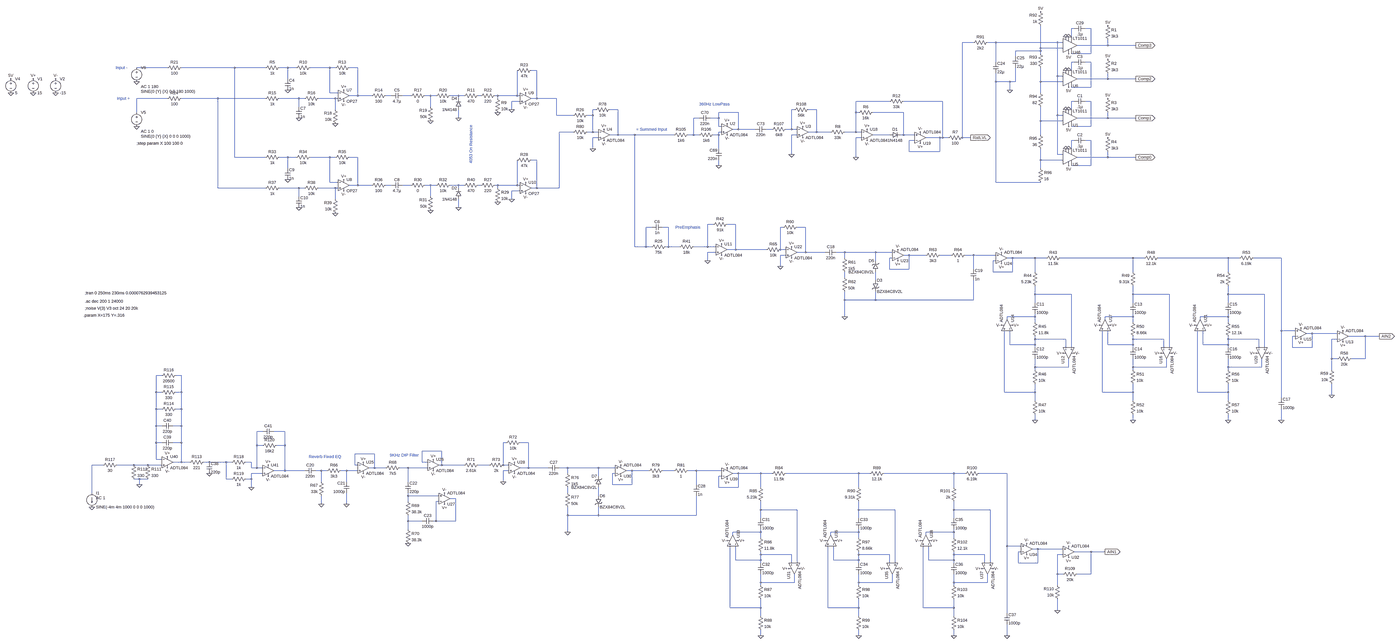
[diagram p0: schematic stargate_323_ltspice_comparator.asc, whole sheet]
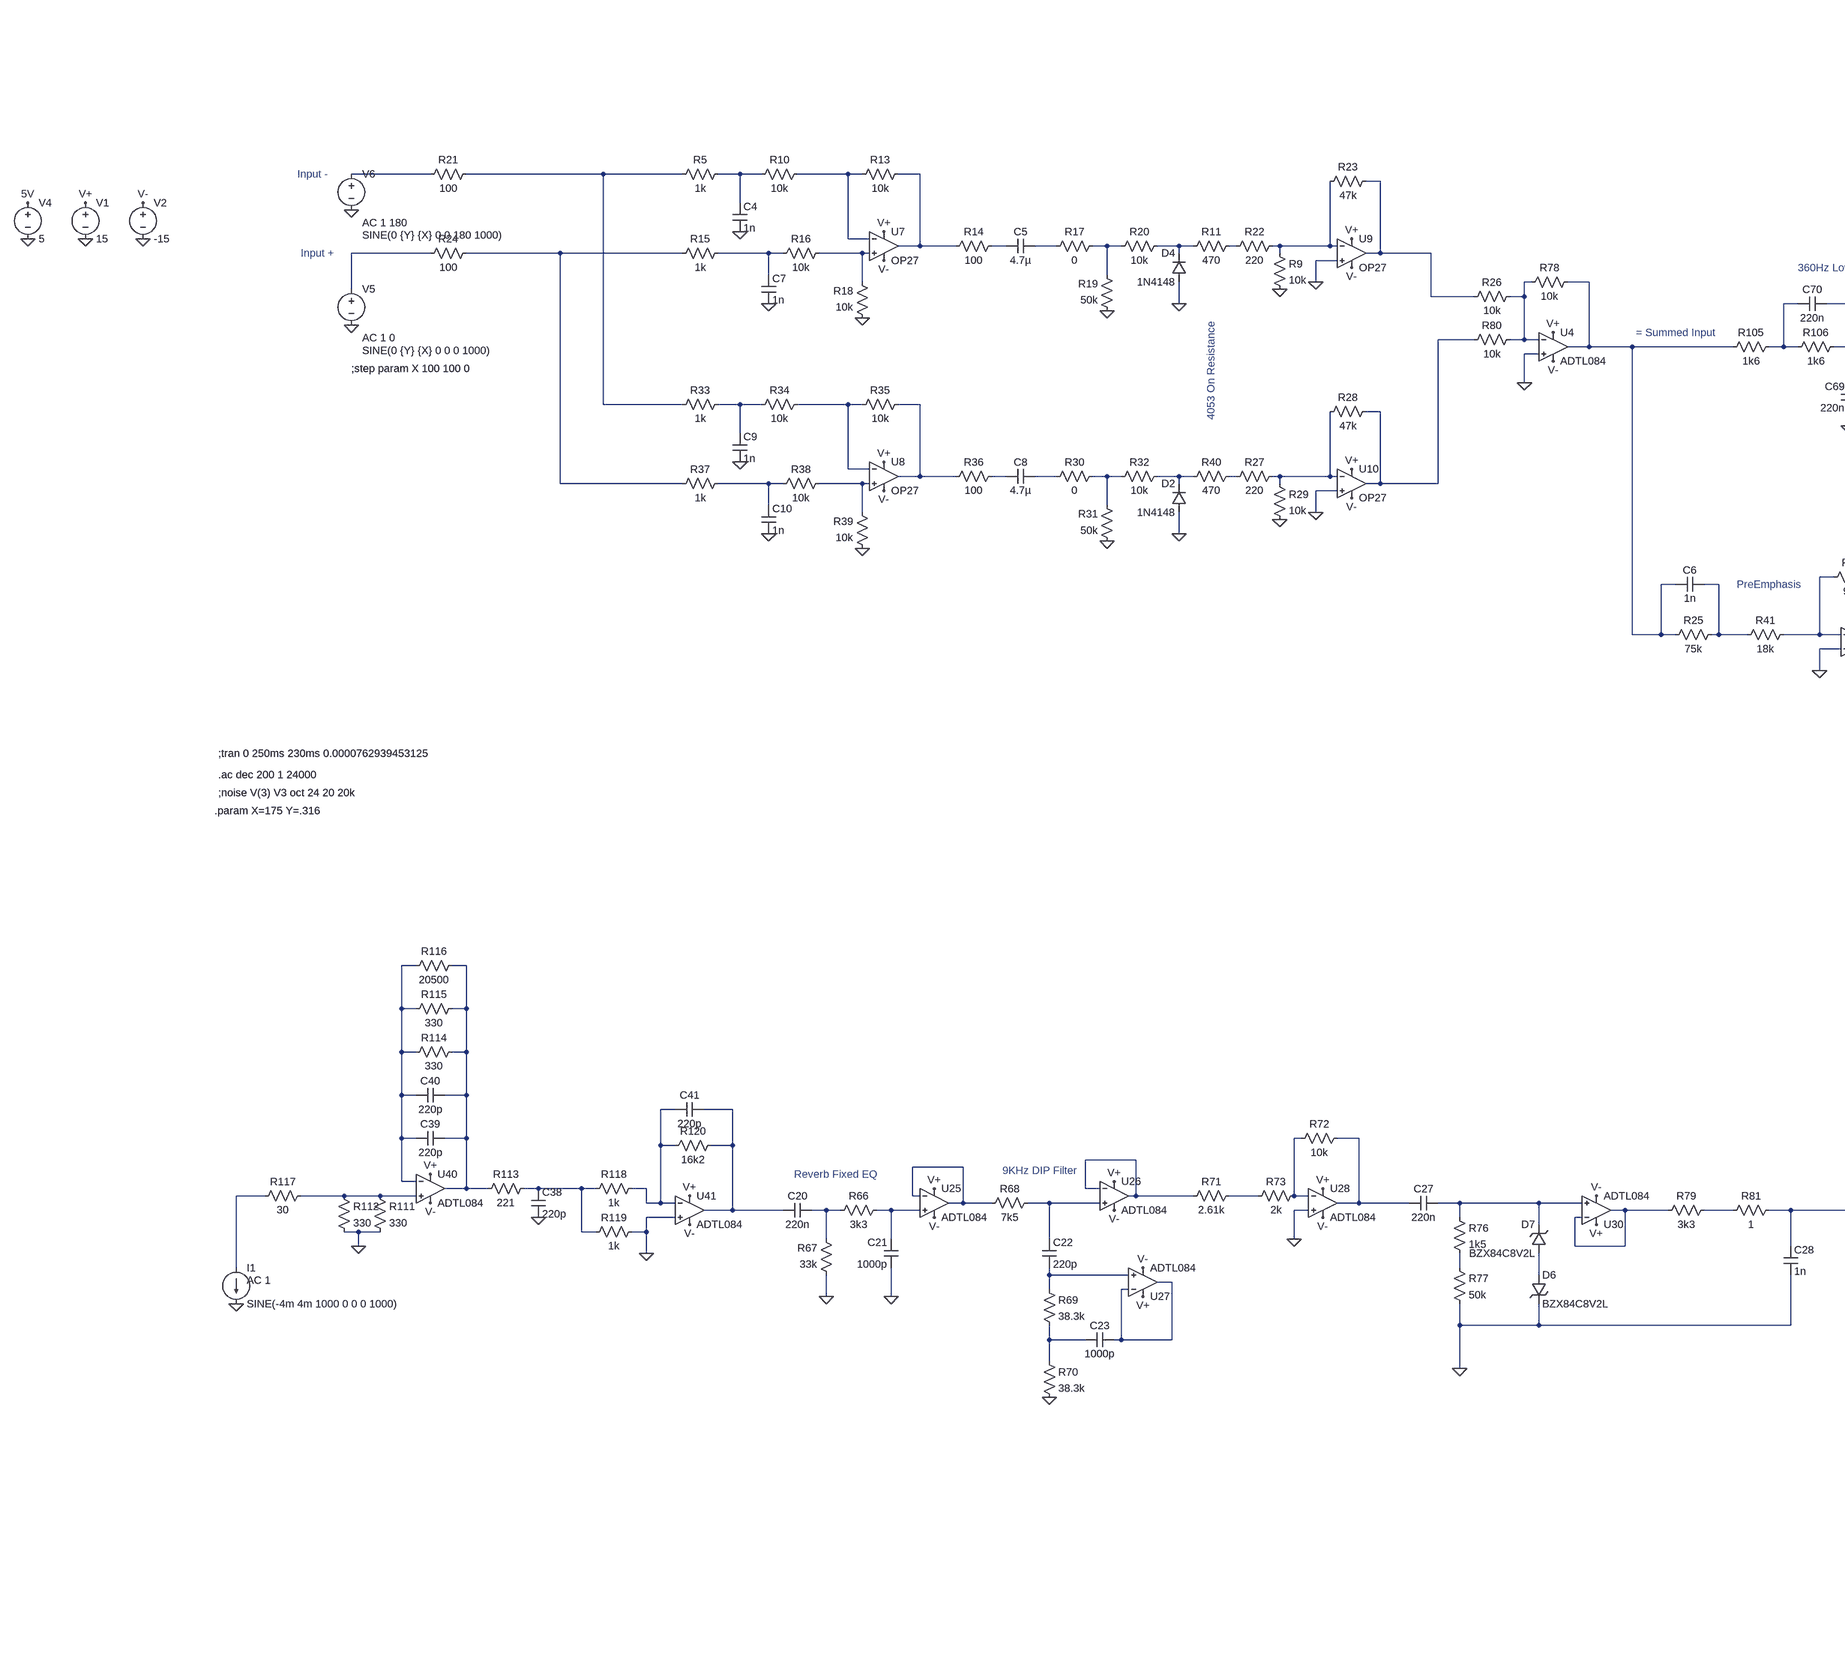
[diagram p1: schematic stargate_323_ltspice_comparator.asc, part, row 1 of 1, column 1 of 2]
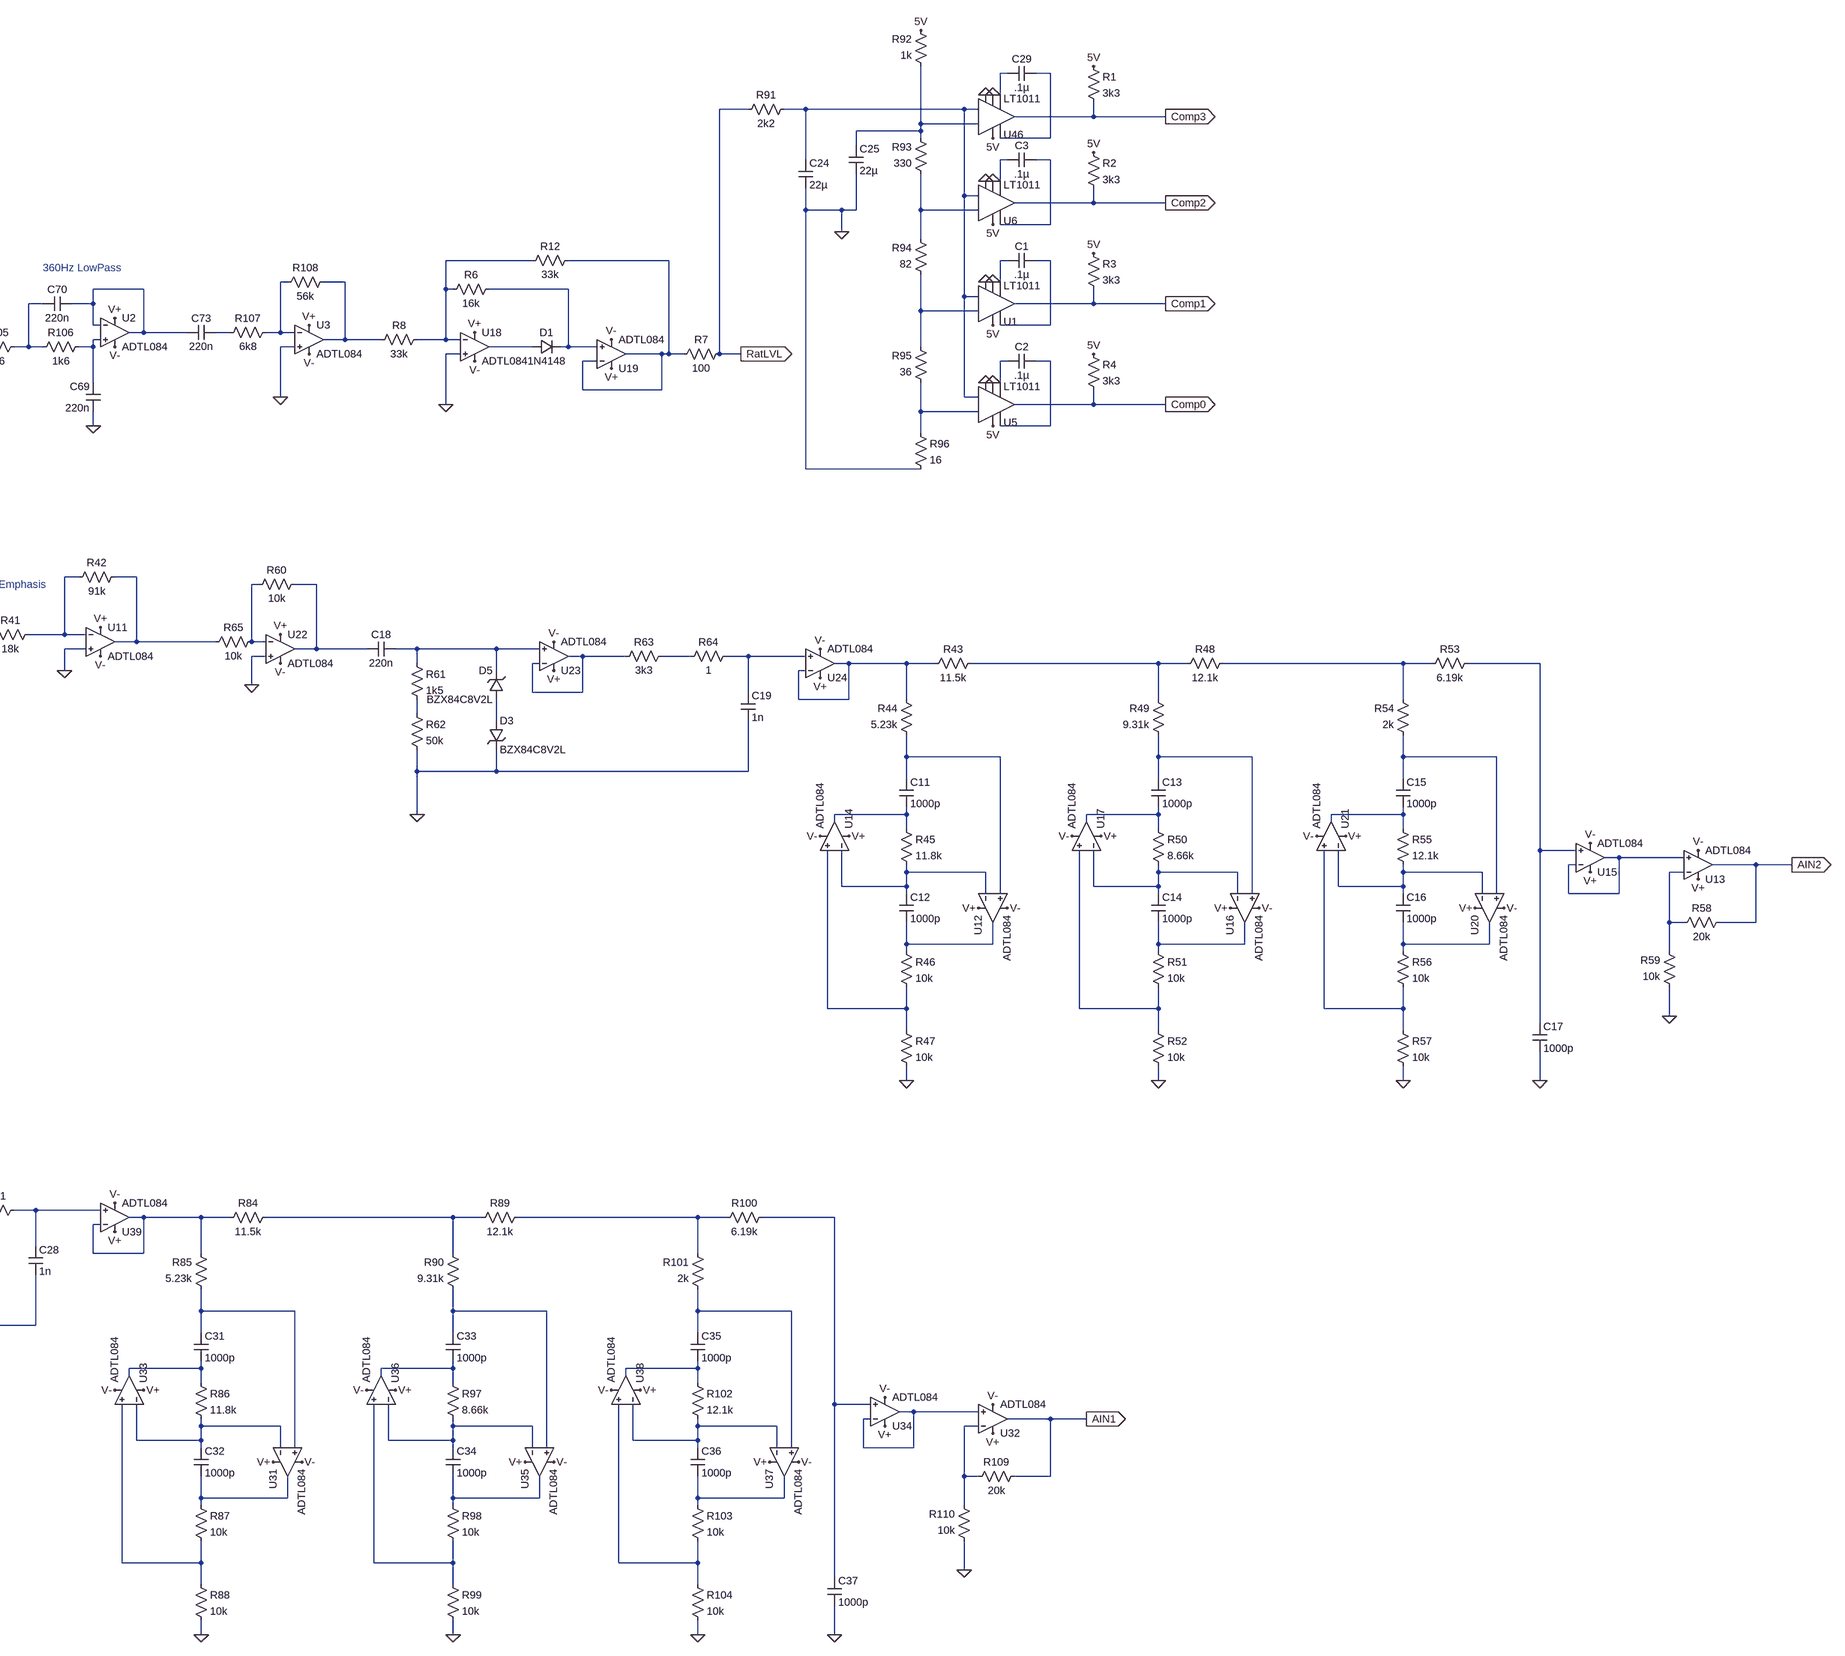
[diagram p2: schematic stargate_323_ltspice_comparator.asc, part, row 1 of 1, column 2 of 2]
stargate_323_ltspice_comparator.asc, the LTspice schematic file:
Version 4
SHEET 1 3908 4260
WIRE 640 -64 624 -64
WIRE 736 -64 704 -64
WIRE 624 -16 624 -64
WIRE 64 16 0 16
WIRE 192 16 144 16
WIRE 544 16 192 16
WIRE 576 16 544 16
WIRE 832 32 832 0
WIRE 832 32 656 32
WIRE 992 32 832 32
WIRE 448 48 448 -80
WIRE 576 48 448 48
WIRE 448 64 448 48
WIRE 448 64 304 64
WIRE 448 80 448 64
WIRE 736 80 736 -64
WIRE 736 80 624 80
WIRE 304 96 304 64
WIRE 192 128 192 16
WIRE 640 128 624 128
WIRE 736 128 704 128
WIRE -4544 160 -4720 160
WIRE -4160 160 -4464 160
WIRE -3984 160 -4160 160
WIRE -3856 160 -3904 160
WIRE -3808 160 -3856 160
WIRE -3616 160 -3728 160
WIRE -3584 160 -3616 160
WIRE -3456 160 -3504 160
WIRE -2432 176 -2464 176
WIRE 624 176 624 128
WIRE 544 208 544 16
WIRE 576 208 544 208
WIRE -3856 224 -3856 160
WIRE 832 224 832 192
WIRE 832 224 656 224
WIRE 992 224 832 224
WIRE 192 240 192 192
WIRE 272 240 192 240
WIRE 304 240 304 160
WIRE 304 240 272 240
WIRE 448 240 448 160
WIRE 576 240 448 240
WIRE 736 272 736 128
WIRE 736 272 624 272
WIRE 272 288 272 240
WIRE -3616 304 -3616 160
WIRE -3568 304 -3616 304
WIRE 448 304 448 240
WIRE -3456 320 -3456 160
WIRE -3456 320 -3504 320
WIRE -3376 320 -3456 320
WIRE -3264 320 -3296 320
WIRE -3152 320 -3200 320
WIRE -3040 320 -3072 320
WIRE -3008 320 -3040 320
WIRE -2880 320 -2928 320
WIRE -2848 320 -2880 320
WIRE -2752 320 -2768 320
WIRE -2656 320 -2672 320
WIRE -2544 320 -2544 176
WIRE -2544 320 -2656 320
WIRE -2528 320 -2544 320
WIRE -4544 336 -4720 336
WIRE -4256 336 -4464 336
WIRE -3984 336 -4256 336
WIRE -3792 336 -3904 336
WIRE -3760 336 -3792 336
WIRE -3584 336 -3680 336
WIRE -3568 336 -3584 336
WIRE -2880 336 -2880 320
WIRE -2656 336 -2656 320
WIRE -2432 336 -2432 176
WIRE -2432 336 -2464 336
WIRE -2320 336 -2432 336
WIRE -2528 352 -2576 352
WIRE -416 352 -608 352
WIRE -112 352 -336 352
WIRE 640 352 624 352
WIRE 736 352 704 352
WIRE -3792 384 -3792 336
WIRE -3040 384 -3040 320
WIRE -3584 400 -3584 336
WIRE -2576 400 -2576 352
WIRE -2096 400 -2112 400
WIRE -1968 400 -2016 400
WIRE -960 400 -976 400
WIRE -832 400 -880 400
WIRE 624 400 624 352
WIRE -4720 416 -4720 336
WIRE -1280 416 -1392 416
WIRE -608 416 -608 352
WIRE -592 416 -608 416
WIRE -336 416 -512 416
WIRE -2320 432 -2320 336
WIRE -2224 432 -2320 432
WIRE -2112 432 -2112 400
WIRE -2112 432 -2144 432
WIRE 544 432 544 208
WIRE 576 432 544 432
WIRE -2880 448 -2880 400
WIRE -1504 448 -1536 448
WIRE -1392 448 -1392 416
WIRE -1392 448 -1440 448
WIRE 832 448 832 416
WIRE 832 448 656 448
WIRE 992 448 832 448
WIRE 448 464 448 384
WIRE 576 464 448 464
WIRE -1392 496 -1392 448
WIRE -1376 496 -1392 496
WIRE 736 496 736 352
WIRE 736 496 624 496
WIRE -1280 512 -1280 416
WIRE -1280 512 -1312 512
WIRE -1184 512 -1280 512
WIRE -1088 512 -1120 512
WIRE -976 512 -976 400
WIRE -976 512 -1008 512
WIRE -944 512 -976 512
WIRE -2224 528 -2304 528
WIRE -2112 528 -2112 432
WIRE -2112 528 -2144 528
WIRE -2080 528 -2112 528
WIRE -1376 528 -1392 528
WIRE -832 528 -832 400
WIRE -832 528 -880 528
WIRE -752 528 -832 528
WIRE -608 528 -608 416
WIRE -608 528 -672 528
WIRE -576 528 -608 528
WIRE -1968 544 -1968 400
WIRE -1968 544 -2016 544
WIRE -1872 544 -1968 544
WIRE -1648 544 -1872 544
WIRE -1536 544 -1536 448
WIRE -1536 544 -1568 544
WIRE -1504 544 -1536 544
WIRE -1392 544 -1392 528
WIRE -1392 544 -1424 544
WIRE -944 544 -976 544
WIRE -416 544 -512 544
WIRE -336 544 -336 416
WIRE -336 544 -352 544
WIRE -272 544 -336 544
WIRE 448 544 448 464
WIRE -2080 560 -2112 560
WIRE -576 560 -608 560
WIRE -128 560 -208 560
WIRE -112 560 -112 352
WIRE -112 560 -128 560
WIRE -80 560 -112 560
WIRE 0 560 0 16
WIRE 48 560 0 560
WIRE -272 576 -304 576
WIRE 640 576 624 576
WIRE 736 576 704 576
WIRE -2112 624 -2112 560
WIRE -1392 624 -1392 544
WIRE 624 624 624 576
WIRE -304 640 -304 576
WIRE -128 640 -128 560
WIRE -128 640 -304 640
WIRE -976 656 -976 544
WIRE 544 656 544 432
WIRE 576 656 544 656
WIRE -4160 672 -4160 160
WIRE -3984 672 -4160 672
WIRE -3856 672 -3904 672
WIRE -3808 672 -3856 672
WIRE -3616 672 -3728 672
WIRE -3584 672 -3616 672
WIRE -3456 672 -3504 672
WIRE -608 672 -608 560
WIRE 832 672 832 640
WIRE 832 672 656 672
WIRE 992 672 832 672
WIRE -2432 688 -2464 688
WIRE 448 688 448 624
WIRE 576 688 448 688
WIRE -1392 720 -1392 688
WIRE 736 720 736 576
WIRE 736 720 624 720
WIRE -3856 736 -3856 672
WIRE 448 736 448 688
WIRE -3616 816 -3616 672
WIRE -3568 816 -3616 816
WIRE 192 816 192 240
WIRE 448 816 192 816
WIRE -3456 832 -3456 672
WIRE -3456 832 -3504 832
WIRE -3376 832 -3456 832
WIRE -3264 832 -3296 832
WIRE -3152 832 -3200 832
WIRE -3040 832 -3072 832
WIRE -3008 832 -3040 832
WIRE -2880 832 -2928 832
WIRE -2848 832 -2880 832
WIRE -2752 832 -2768 832
WIRE -2656 832 -2672 832
WIRE -2544 832 -2544 688
WIRE -2544 832 -2656 832
WIRE -2528 832 -2544 832
WIRE -4256 848 -4256 336
WIRE -3984 848 -4256 848
WIRE -3792 848 -3904 848
WIRE -3760 848 -3792 848
WIRE -3584 848 -3680 848
WIRE -3568 848 -3584 848
WIRE -2880 848 -2880 832
WIRE -2656 848 -2656 832
WIRE -2432 848 -2432 688
WIRE -2432 848 -2464 848
WIRE -2304 848 -2304 528
WIRE -2304 848 -2432 848
WIRE -2528 864 -2576 864
WIRE -3792 896 -3792 848
WIRE -3040 896 -3040 832
WIRE -3584 912 -3584 848
WIRE -2576 912 -2576 864
WIRE -2880 960 -2880 912
WIRE -1424 1056 -1456 1056
WIRE -1296 1056 -1344 1056
WIRE -1776 1072 -1808 1072
WIRE -1680 1072 -1712 1072
WIRE -1024 1072 -1040 1072
WIRE -896 1072 -944 1072
WIRE -1872 1184 -1872 544
WIRE -1808 1184 -1808 1072
WIRE -1808 1184 -1872 1184
WIRE -1776 1184 -1808 1184
WIRE -1680 1184 -1680 1072
WIRE -1680 1184 -1696 1184
WIRE -1616 1184 -1680 1184
WIRE -1456 1184 -1456 1056
WIRE -1456 1184 -1536 1184
WIRE -1408 1184 -1456 1184
WIRE -1296 1200 -1296 1056
WIRE -1296 1200 -1344 1200
WIRE -1120 1200 -1296 1200
WIRE -1040 1200 -1040 1072
WIRE -1008 1200 -1040 1200
WIRE -1408 1216 -1456 1216
WIRE -896 1216 -896 1072
WIRE -896 1216 -944 1216
WIRE -784 1216 -896 1216
WIRE -672 1216 -720 1216
WIRE -496 1216 -672 1216
WIRE -400 1216 -496 1216
WIRE -1008 1232 -1040 1232
WIRE -304 1232 -336 1232
WIRE -208 1232 -304 1232
WIRE -64 1232 -128 1232
WIRE 64 1232 16 1232
WIRE 192 1232 64 1232
WIRE -672 1248 -672 1216
WIRE -400 1248 -416 1248
WIRE 288 1248 256 1248
WIRE 416 1248 288 1248
WIRE 480 1248 416 1248
WIRE 976 1248 560 1248
WIRE 1040 1248 976 1248
WIRE 1520 1248 1120 1248
WIRE 1584 1248 1520 1248
WIRE 1824 1248 1664 1248
WIRE -1456 1264 -1456 1216
WIRE -496 1264 -496 1216
WIRE 192 1264 176 1264
WIRE -1040 1296 -1040 1232
WIRE -416 1312 -416 1248
WIRE -304 1312 -304 1232
WIRE -304 1312 -416 1312
WIRE 64 1312 64 1232
WIRE 176 1328 176 1264
WIRE 288 1328 288 1248
WIRE 288 1328 176 1328
WIRE 416 1328 416 1248
WIRE 976 1328 976 1248
WIRE 1520 1328 1520 1248
WIRE -672 1360 -672 1328
WIRE -496 1376 -496 1328
WIRE 416 1456 416 1408
WIRE 624 1456 416 1456
WIRE 976 1456 976 1408
WIRE 1184 1456 976 1456
WIRE 1520 1456 1520 1408
WIRE 1728 1456 1520 1456
WIRE -672 1488 -672 1440
WIRE -496 1488 -496 1440
WIRE -496 1488 -672 1488
WIRE 64 1488 64 1376
WIRE 64 1488 -496 1488
WIRE 416 1504 416 1456
WIRE 976 1504 976 1456
WIRE 1520 1504 1520 1456
WIRE -672 1584 -672 1488
WIRE 416 1584 416 1568
WIRE 416 1584 256 1584
WIRE 976 1584 976 1568
WIRE 976 1584 816 1584
WIRE 1520 1584 1520 1568
WIRE 1520 1584 1360 1584
WIRE 256 1600 256 1584
WIRE 816 1600 816 1584
WIRE 1360 1600 1360 1584
WIRE 416 1616 416 1584
WIRE 976 1616 976 1584
WIRE 1520 1616 1520 1584
WIRE 1824 1664 1824 1248
WIRE 1904 1664 1824 1664
WIRE 2000 1680 1968 1680
WIRE 2144 1680 2000 1680
WIRE 1904 1696 1888 1696
WIRE 2304 1696 2208 1696
WIRE 2384 1696 2304 1696
WIRE 416 1712 416 1696
WIRE 592 1712 416 1712
WIRE 976 1712 976 1696
WIRE 1152 1712 976 1712
WIRE 1520 1712 1520 1696
WIRE 1696 1712 1520 1712
WIRE 2144 1712 2112 1712
WIRE 272 1744 272 1664
WIRE 416 1744 416 1712
WIRE 416 1744 272 1744
WIRE 832 1744 832 1664
WIRE 976 1744 976 1712
WIRE 976 1744 832 1744
WIRE 1376 1744 1376 1664
WIRE 1520 1744 1520 1712
WIRE 1520 1744 1376 1744
WIRE 416 1760 416 1744
WIRE 592 1760 592 1712
WIRE 624 1760 624 1456
WIRE 976 1760 976 1744
WIRE 1152 1760 1152 1712
WIRE 1184 1760 1184 1456
WIRE 1520 1760 1520 1744
WIRE 1696 1760 1696 1712
WIRE 1728 1760 1728 1456
WIRE 1888 1760 1888 1696
WIRE 2000 1760 2000 1680
WIRE 2000 1760 1888 1760
WIRE 2112 1824 2112 1712
WIRE 2144 1824 2112 1824
WIRE 2304 1824 2304 1696
WIRE 2304 1824 2224 1824
WIRE 416 1872 416 1824
WIRE 608 1872 608 1824
WIRE 608 1872 416 1872
WIRE 976 1872 976 1824
WIRE 1168 1872 1168 1824
WIRE 1168 1872 976 1872
WIRE 1520 1872 1520 1824
WIRE 1712 1872 1712 1824
WIRE 1712 1872 1520 1872
WIRE 416 1888 416 1872
WIRE 976 1888 976 1872
WIRE 1520 1888 1520 1872
WIRE 2112 1888 2112 1824
WIRE -4576 1920 -4608 1920
WIRE -4464 1920 -4496 1920
WIRE -4608 2016 -4608 1920
WIRE -4576 2016 -4608 2016
WIRE -4464 2016 -4464 1920
WIRE -4464 2016 -4496 2016
WIRE 240 2016 240 1664
WIRE 416 2016 416 1968
WIRE 416 2016 240 2016
WIRE 800 2016 800 1664
WIRE 976 2016 976 1968
WIRE 976 2016 800 2016
WIRE 1344 2016 1344 1664
WIRE 1520 2016 1520 1968
WIRE 1520 2016 1344 2016
WIRE 2112 2032 2112 1968
WIRE 1824 2048 1824 1664
WIRE 416 2064 416 2016
WIRE 976 2064 976 2016
WIRE 1520 2064 1520 2016
WIRE -4608 2112 -4608 2016
WIRE -4576 2112 -4608 2112
WIRE -4464 2112 -4464 2016
WIRE -4464 2112 -4496 2112
WIRE 416 2176 416 2144
WIRE 976 2176 976 2144
WIRE 1520 2176 1520 2144
WIRE 1824 2176 1824 2112
WIRE -4608 2208 -4608 2112
WIRE -4576 2208 -4608 2208
WIRE -4464 2208 -4464 2112
WIRE -4464 2208 -4512 2208
WIRE -4000 2240 -4032 2240
WIRE -3872 2240 -3936 2240
WIRE -4608 2304 -4608 2208
WIRE -4576 2304 -4608 2304
WIRE -4464 2304 -4464 2208
WIRE -4464 2304 -4512 2304
WIRE -2608 2304 -2624 2304
WIRE -2480 2304 -2528 2304
WIRE -4032 2320 -4032 2240
WIRE -4000 2320 -4032 2320
WIRE -3872 2320 -3872 2240
WIRE -3872 2320 -3920 2320
WIRE -2976 2352 -3088 2352
WIRE -3360 2368 -3472 2368
WIRE -4608 2400 -4608 2304
WIRE -4576 2400 -4608 2400
WIRE -4464 2416 -4464 2304
WIRE -4464 2416 -4512 2416
WIRE -4416 2416 -4464 2416
WIRE -4304 2416 -4336 2416
WIRE -4208 2416 -4304 2416
WIRE -4176 2416 -4208 2416
WIRE -4064 2416 -4096 2416
WIRE -3088 2416 -3088 2352
WIRE -3056 2416 -3088 2416
WIRE -4912 2432 -4976 2432
WIRE -4736 2432 -4832 2432
WIRE -4656 2432 -4736 2432
WIRE -4576 2432 -4656 2432
WIRE -3472 2432 -3472 2368
WIRE -3456 2432 -3472 2432
WIRE -2976 2432 -2976 2352
WIRE -2976 2432 -2992 2432
WIRE -2848 2432 -2976 2432
WIRE -2704 2432 -2768 2432
WIRE -2624 2432 -2624 2304
WIRE -2592 2432 -2624 2432
WIRE -4064 2448 -4064 2416
WIRE -4032 2448 -4032 2320
WIRE -4032 2448 -4064 2448
WIRE -4000 2448 -4032 2448
WIRE -3360 2448 -3360 2368
WIRE -3360 2448 -3392 2448
WIRE -3296 2448 -3360 2448
WIRE -3168 2448 -3216 2448
WIRE -3056 2448 -3168 2448
WIRE -2480 2448 -2480 2304
WIRE -2480 2448 -2528 2448
WIRE -2368 2448 -2480 2448
WIRE -2256 2448 -2304 2448
WIRE -2080 2448 -2256 2448
WIRE -1984 2448 -2080 2448
WIRE -3872 2464 -3872 2320
WIRE -3872 2464 -3936 2464
WIRE -3760 2464 -3872 2464
WIRE -3664 2464 -3696 2464
WIRE -3632 2464 -3664 2464
WIRE -3520 2464 -3552 2464
WIRE -3456 2464 -3520 2464
WIRE -2592 2464 -2624 2464
WIRE -1888 2464 -1920 2464
WIRE -1792 2464 -1888 2464
WIRE -1648 2464 -1712 2464
WIRE -1520 2464 -1568 2464
WIRE -1376 2464 -1520 2464
WIRE -4000 2480 -4064 2480
WIRE -2256 2480 -2256 2448
WIRE -1984 2480 -2000 2480
WIRE -1280 2480 -1312 2480
WIRE -1152 2480 -1280 2480
WIRE -1088 2480 -1152 2480
WIRE -592 2480 -1008 2480
WIRE -528 2480 -592 2480
WIRE -48 2480 -448 2480
WIRE 16 2480 -48 2480
WIRE 256 2480 96 2480
WIRE -2080 2496 -2080 2448
WIRE -1376 2496 -1392 2496
WIRE -4704 2512 -4736 2512
WIRE -4656 2512 -4704 2512
WIRE -4208 2512 -4208 2416
WIRE -4176 2512 -4208 2512
WIRE -4064 2512 -4064 2480
WIRE -4064 2512 -4096 2512
WIRE -3664 2528 -3664 2464
WIRE -3520 2528 -3520 2464
WIRE -3168 2528 -3168 2448
WIRE -2624 2528 -2624 2464
WIRE -4704 2544 -4704 2512
WIRE -2000 2544 -2000 2480
WIRE -1888 2544 -1888 2464
WIRE -1888 2544 -2000 2544
WIRE -1520 2544 -1520 2464
WIRE -4064 2560 -4064 2512
WIRE -1392 2560 -1392 2496
WIRE -1280 2560 -1280 2480
WIRE -1280 2560 -1392 2560
WIRE -1152 2560 -1152 2480
WIRE -592 2560 -592 2480
WIRE -48 2560 -48 2480
WIRE -4976 2592 -4976 2432
WIRE -2256 2592 -2256 2560
WIRE -3168 2608 -3168 2592
WIRE -2992 2608 -3168 2608
WIRE -2080 2608 -2080 2560
WIRE -2896 2624 -2928 2624
WIRE -3168 2640 -3168 2608
WIRE -2992 2640 -3008 2640
WIRE -3664 2656 -3664 2608
WIRE -3520 2656 -3520 2592
WIRE -1152 2688 -1152 2640
WIRE -944 2688 -1152 2688
WIRE -592 2688 -592 2640
WIRE -384 2688 -592 2688
WIRE -48 2688 -48 2640
WIRE 160 2688 -48 2688
WIRE -2256 2720 -2256 2672
WIRE -2080 2720 -2080 2672
WIRE -2080 2720 -2256 2720
WIRE -1520 2720 -1520 2608
WIRE -1520 2720 -2080 2720
WIRE -1152 2736 -1152 2688
WIRE -592 2736 -592 2688
WIRE -48 2736 -48 2688
WIRE -3168 2752 -3168 2720
WIRE -3088 2752 -3168 2752
WIRE -3008 2752 -3008 2640
WIRE -3008 2752 -3024 2752
WIRE -2896 2752 -2896 2624
WIRE -2896 2752 -3008 2752
WIRE -3168 2800 -3168 2752
WIRE -2256 2816 -2256 2720
WIRE -1152 2816 -1152 2800
WIRE -1152 2816 -1312 2816
WIRE -592 2816 -592 2800
WIRE -592 2816 -752 2816
WIRE -48 2816 -48 2800
WIRE -48 2816 -208 2816
WIRE -1312 2832 -1312 2816
WIRE -752 2832 -752 2816
WIRE -208 2832 -208 2816
WIRE -1152 2848 -1152 2816
WIRE -592 2848 -592 2816
WIRE -48 2848 -48 2816
WIRE 256 2896 256 2480
WIRE 336 2896 256 2896
WIRE 432 2912 400 2912
WIRE 576 2912 432 2912
WIRE 336 2928 320 2928
WIRE 736 2928 640 2928
WIRE 816 2928 736 2928
WIRE -1152 2944 -1152 2928
WIRE -976 2944 -1152 2944
WIRE -592 2944 -592 2928
WIRE -416 2944 -592 2944
WIRE -48 2944 -48 2928
WIRE 128 2944 -48 2944
WIRE 576 2944 544 2944
WIRE -1296 2976 -1296 2896
WIRE -1152 2976 -1152 2944
WIRE -1152 2976 -1296 2976
WIRE -736 2976 -736 2896
WIRE -592 2976 -592 2944
WIRE -592 2976 -736 2976
WIRE -192 2976 -192 2896
WIRE -48 2976 -48 2944
WIRE -48 2976 -192 2976
WIRE -1152 2992 -1152 2976
WIRE -976 2992 -976 2944
WIRE -944 2992 -944 2688
WIRE -592 2992 -592 2976
WIRE -416 2992 -416 2944
WIRE -384 2992 -384 2688
WIRE -48 2992 -48 2976
WIRE 128 2992 128 2944
WIRE 160 2992 160 2688
WIRE 320 2992 320 2928
WIRE 432 2992 432 2912
WIRE 432 2992 320 2992
WIRE 544 3056 544 2944
WIRE 576 3056 544 3056
WIRE 736 3056 736 2928
WIRE 736 3056 656 3056
WIRE -1152 3104 -1152 3056
WIRE -960 3104 -960 3056
WIRE -960 3104 -1152 3104
WIRE -592 3104 -592 3056
WIRE -400 3104 -400 3056
WIRE -400 3104 -592 3104
WIRE -48 3104 -48 3056
WIRE 144 3104 144 3056
WIRE 144 3104 -48 3104
WIRE -1152 3120 -1152 3104
WIRE -592 3120 -592 3104
WIRE -48 3120 -48 3104
WIRE 544 3120 544 3056
WIRE -1328 3248 -1328 2896
WIRE -1152 3248 -1152 3200
WIRE -1152 3248 -1328 3248
WIRE -768 3248 -768 2896
WIRE -592 3248 -592 3200
WIRE -592 3248 -768 3248
WIRE -224 3248 -224 2896
WIRE -48 3248 -48 3200
WIRE -48 3248 -224 3248
WIRE 544 3264 544 3200
WIRE 256 3280 256 2896
WIRE -1152 3296 -1152 3248
WIRE -592 3296 -592 3248
WIRE -48 3296 -48 3248
WIRE -1152 3408 -1152 3376
WIRE -592 3408 -592 3376
WIRE -48 3408 -48 3376
WIRE 256 3408 256 3344
FLAG -5376 304 0
FLAG -5376 224 V+
FLAG -5248 304 0
FLAG -5248 224 V-
FLAG -1344 480 V+
FLAG -1344 544 V-
FLAG -1392 720 0
FLAG 48 560 RatLVL
IOPIN 48 560 Out
FLAG -912 496 V+
FLAG -912 560 V-
FLAG -976 656 0
FLAG -2048 512 V+
FLAG -2048 576 V-
FLAG -2112 624 0
FLAG -544 512 V+
FLAG -544 576 V-
FLAG -608 672 0
FLAG -240 592 V+
FLAG -240 528 V-
FLAG -2496 304 V+
FLAG -2496 368 V-
FLAG -2576 400 0
FLAG -2656 416 0
FLAG -3040 464 0
FLAG -2880 448 0
FLAG 272 288 0
FLAG -5504 304 0
FLAG -5504 224 5V
FLAG 592 -16 0
FLAG 608 -16 0
FLAG 608 80 5V
FLAG 992 32 Comp3
IOPIN 992 32 Out
FLAG 592 400 0
FLAG 608 400 0
FLAG 608 496 5V
FLAG 992 448 Comp1
IOPIN 992 448 Out
FLAG 592 624 0
FLAG 608 624 0
FLAG 608 720 5V
FLAG 992 672 Comp0
IOPIN 992 672 Out
FLAG 592 176 0
FLAG 608 176 0
FLAG 608 272 5V
FLAG 992 224 Comp2
IOPIN 992 224 Out
FLAG 832 -80 5V
FLAG 832 112 5V
FLAG 832 336 5V
FLAG 832 560 5V
FLAG 448 -160 5V
FLAG -4720 240 0
FLAG -4720 496 0
FLAG -3536 288 V+
FLAG -3536 352 V-
FLAG -3856 288 0
FLAG -3792 448 0
FLAG -3584 480 0
FLAG -2496 816 V+
FLAG -2496 880 V-
FLAG -2576 912 0
FLAG -2656 928 0
FLAG -3040 976 0
FLAG -2880 960 0
FLAG -3536 800 V+
FLAG -3536 864 V-
FLAG -3856 800 0
FLAG -3792 960 0
FLAG -3584 992 0
FLAG -1376 1168 V+
FLAG -1376 1232 V-
FLAG -1456 1264 0
FLAG 576 1792 V+
FLAG 640 1792 V-
FLAG 2176 1728 V+
FLAG 2176 1664 V-
FLAG 288 1632 V+
FLAG 224 1632 V-
FLAG 1936 1712 V+
FLAG 1936 1648 V-
FLAG 416 2176 0
FLAG 1136 1792 V+
FLAG 1200 1792 V-
FLAG 848 1632 V+
FLAG 784 1632 V-
FLAG 976 2176 0
FLAG 1680 1792 V+
FLAG 1744 1792 V-
FLAG 1392 1632 V+
FLAG 1328 1632 V-
FLAG 1520 2176 0
FLAG 1824 2176 0
FLAG 2112 2032 0
FLAG 2384 1696 AIN2
IOPIN 2384 1696 Out
FLAG -976 1184 V+
FLAG -976 1248 V-
FLAG -1040 1296 0
FLAG -672 1584 0
FLAG -368 1264 V+
FLAG -368 1200 V-
FLAG 224 1280 V+
FLAG 224 1216 V-
FLAG -3424 2416 V+
FLAG -3424 2480 V-
FLAG -3024 2400 V+
FLAG -3024 2464 V-
FLAG -2960 2656 V+
FLAG -2960 2592 V-
FLAG -3664 2656 0
FLAG -3520 2656 0
FLAG -3168 2880 0
FLAG -2560 2416 V+
FLAG -2560 2480 V-
FLAG -2624 2528 0
FLAG -2256 2816 0
FLAG -1952 2496 V+
FLAG -1952 2432 V-
FLAG -992 3024 V+
FLAG -928 3024 V-
FLAG 608 2960 V+
FLAG 608 2896 V-
FLAG -1280 2864 V+
FLAG -1344 2864 V-
FLAG 368 2944 V+
FLAG 368 2880 V-
FLAG -1152 3408 0
FLAG -432 3024 V+
FLAG -368 3024 V-
FLAG -720 2864 V+
FLAG -784 2864 V-
FLAG -592 3408 0
FLAG 112 3024 V+
FLAG 176 3024 V-
FLAG -176 2864 V+
FLAG -240 2864 V-
FLAG -48 3408 0
FLAG 256 3408 0
FLAG 544 3264 0
FLAG 816 2928 AIN1
IOPIN 816 2928 Out
FLAG -1344 2512 V+
FLAG -1344 2448 V-
FLAG -4544 2384 V+
FLAG -4544 2448 V-
FLAG -4976 2672 0
FLAG -4704 2544 0
FLAG -4304 2480 0
FLAG -3968 2432 V+
FLAG -3968 2496 V-
FLAG -4064 2560 0
SYMBOL voltage -5376 208 R0
WINDOW 123 0 0 Left 0
WINDOW 39 0 0 Left 0
SYMATTR InstName V1
SYMATTR Value 15
SYMBOL voltage -5248 208 R0
WINDOW 123 0 0 Left 0
WINDOW 39 0 0 Left 0
SYMATTR InstName V2
SYMATTR Value -15
SYMBOL res -1552 528 R90
WINDOW 0 0 56 VBottom 2
WINDOW 3 32 56 VTop 2
SYMATTR InstName R105
SYMATTR Value 1k6
SYMBOL res -1408 528 R90
WINDOW 0 0 56 VBottom 2
WINDOW 3 32 56 VTop 2
SYMATTR InstName R106
SYMATTR Value 1k6
SYMBOL cap -1440 432 R90
WINDOW 0 0 32 VBottom 2
WINDOW 3 32 32 VTop 2
SYMATTR InstName C70
SYMATTR Value 220n
SYMBOL cap -1376 688 R180
WINDOW 0 24 56 Left 2
WINDOW 3 24 8 Left 2
SYMATTR InstName C69
SYMATTR Value 220n
SYMBOL OpAmps\\ADTL084 -1344 448 R0
SYMATTR InstName U2
SYMBOL cap -1120 496 R90
WINDOW 0 0 32 VBottom 2
WINDOW 3 32 32 VTop 2
SYMATTR InstName C73
SYMATTR Value 220n
SYMBOL res -992 496 R90
WINDOW 0 0 56 VBottom 2
WINDOW 3 32 56 VTop 2
SYMATTR InstName R107
SYMATTR Value 6k8
SYMBOL res -864 384 R90
WINDOW 0 0 56 VBottom 2
WINDOW 3 32 56 VTop 2
SYMATTR InstName R108
SYMATTR Value 56k
SYMBOL OpAmps\\ADTL084 -912 464 R0
SYMATTR InstName U3
SYMBOL OpAmps\\ADTL084 -2048 480 R0
SYMATTR InstName U4
SYMBOL res -2000 384 R90
WINDOW 0 0 56 VBottom 2
WINDOW 3 32 56 VTop 2
SYMATTR InstName R78
SYMATTR Value 10k
SYMBOL res -2128 512 R90
WINDOW 0 0 56 VBottom 2
WINDOW 3 32 56 VTop 2
SYMATTR InstName R80
SYMATTR Value 10k
SYMBOL res -496 400 R90
WINDOW 0 0 56 VBottom 2
WINDOW 3 32 56 VTop 2
SYMATTR InstName R6
SYMATTR Value 16k
SYMBOL OpAmps\\ADTL084 -544 480 R0
SYMATTR InstName U18
SYMBOL OpAmps\\ADTL084 -240 624 M180
SYMATTR InstName U19
SYMBOL res -656 512 R90
WINDOW 0 0 56 VBottom 2
WINDOW 3 32 56 VTop 2
SYMATTR InstName R8
SYMATTR Value 33k
SYMBOL res 16 544 R90
WINDOW 0 0 56 VBottom 2
WINDOW 3 32 56 VTop 2
SYMATTR InstName R7
SYMATTR Value 100
SYMBOL res -320 336 R90
WINDOW 0 0 56 VBottom 2
WINDOW 3 32 56 VTop 2
SYMATTR InstName R12
SYMATTR Value 33k
SYMBOL diode -416 560 R270
WINDOW 0 32 32 VTop 2
WINDOW 3 0 32 VBottom 2
SYMATTR InstName D1
SYMATTR Value 1N4148
SYMBOL res -2656 304 R90
WINDOW 0 0 56 VBottom 2
WINDOW 3 32 56 VTop 2
SYMATTR InstName R22
SYMATTR Value 220
SYMBOL res -2448 160 R90
WINDOW 0 0 56 VBottom 2
WINDOW 3 32 56 VTop 2
SYMATTR InstName R23
SYMATTR Value 47k
SYMBOL res -2672 320 R0
SYMATTR InstName R9
SYMATTR Value 10k
SYMBOL cap -3200 304 R90
WINDOW 0 0 32 VBottom 2
WINDOW 3 32 32 VTop 2
SYMATTR InstName C5
SYMATTR Value 4.7µ
SYMBOL res -3056 304 R90
WINDOW 0 0 56 VBottom 2
WINDOW 3 32 56 VTop 2
SYMATTR InstName R17
SYMATTR Value 0
SYMBOL res -3024 480 R180
WINDOW 0 36 76 Left 2
WINDOW 3 36 40 Left 2
SYMATTR InstName R19
SYMATTR Value 50k
SYMBOL res -2912 304 R90
WINDOW 0 0 56 VBottom 2
WINDOW 3 32 56 VTop 2
SYMATTR InstName R20
SYMATTR Value 10k
SYMBOL diode -2864 400 R180
WINDOW 0 24 64 Left 2
WINDOW 3 24 0 Left 2
SYMATTR InstName D4
SYMATTR Value 1N4148
SYMBOL res 160 0 R90
WINDOW 0 0 56 VBottom 2
WINDOW 3 32 56 VTop 2
SYMATTR InstName R91
SYMATTR Value 2k2
SYMBOL res 464 -64 R180
WINDOW 0 36 76 Left 2
WINDOW 3 36 40 Left 2
SYMATTR InstName R92
SYMATTR Value 1k
SYMBOL res 464 176 R180
WINDOW 0 36 76 Left 2
WINDOW 3 36 40 Left 2
SYMATTR InstName R93
SYMATTR Value 330
SYMBOL res 464 400 R180
WINDOW 0 36 76 Left 2
WINDOW 3 36 40 Left 2
SYMATTR InstName R94
SYMATTR Value 82
SYMBOL res 464 640 R180
WINDOW 0 36 76 Left 2
WINDOW 3 36 40 Left 2
SYMATTR InstName R95
SYMATTR Value 36
SYMBOL res 432 720 R0
SYMATTR InstName R96
SYMATTR Value 16
SYMBOL cap 176 128 R0
SYMATTR InstName C24
SYMATTR Value 22µ
SYMBOL cap 288 96 R0
SYMATTR InstName C25
SYMATTR Value 22µ
SYMBOL voltage -5504 208 R0
WINDOW 123 0 0 Left 0
WINDOW 39 0 0 Left 0
SYMATTR InstName V4
SYMATTR Value 5
SYMBOL Comparators\\LT1011 608 32 M180
SYMATTR InstName U46
SYMBOL cap 704 -48 M270
WINDOW 0 32 32 VTop 2
WINDOW 3 0 32 VBottom 2
SYMATTR InstName C29
SYMATTR Value .1µ
SYMBOL Comparators\\LT1011 608 448 M180
SYMATTR InstName U1
SYMBOL cap 704 368 M270
WINDOW 0 32 32 VTop 2
WINDOW 3 0 32 VBottom 2
SYMATTR InstName C1
SYMATTR Value .1µ
SYMBOL Comparators\\LT1011 608 672 M180
SYMATTR InstName U5
SYMBOL cap 704 592 M270
WINDOW 0 32 32 VTop 2
WINDOW 3 0 32 VBottom 2
SYMATTR InstName C2
SYMATTR Value .1µ
SYMBOL Comparators\\LT1011 608 224 M180
SYMATTR InstName U6
SYMBOL cap 704 144 M270
WINDOW 0 32 32 VTop 2
WINDOW 3 0 32 VBottom 2
SYMATTR InstName C3
SYMATTR Value .1µ
SYMBOL res 816 -96 R0
SYMATTR InstName R1
SYMATTR Value 3k3
SYMBOL res 816 96 R0
SYMATTR InstName R2
SYMATTR Value 3k3
SYMBOL res 816 320 R0
SYMATTR InstName R3
SYMATTR Value 3k3
SYMBOL res 816 544 R0
SYMATTR InstName R4
SYMATTR Value 3k3
SYMBOL OpAmps\\OP27 -3536 256 R0
SYMATTR InstName U7
SYMBOL voltage -4720 400 R0
WINDOW 3 24 152 Left 2
WINDOW 123 24 124 Left 2
WINDOW 39 24 44 Left 2
SYMATTR Value SINE(0 {Y} {X} 0 0 0 1000)
SYMATTR Value2 AC 1 0
SYMATTR InstName V5
SYMBOL voltage -4720 144 R0
WINDOW 3 24 152 Left 2
WINDOW 123 24 124 Left 2
WINDOW 39 24 44 Left 2
SYMATTR Value SINE(0 {Y} {X} 0 0 180 1000)
SYMATTR Value2 AC 1 180
SYMATTR InstName V6
SYMBOL OpAmps\\OP27 -2496 272 R0
SYMATTR InstName U9
SYMBOL res -3888 144 R90
WINDOW 0 0 56 VBottom 2
WINDOW 3 32 56 VTop 2
SYMATTR InstName R5
SYMATTR Value 1k
SYMBOL res -3712 144 R90
WINDOW 0 0 56 VBottom 2
WINDOW 3 32 56 VTop 2
SYMATTR InstName R10
SYMATTR Value 10k
SYMBOL res -3488 144 R90
WINDOW 0 0 56 VBottom 2
WINDOW 3 32 56 VTop 2
SYMATTR InstName R13
SYMATTR Value 10k
SYMBOL res -3280 304 R90
WINDOW 0 0 56 VBottom 2
WINDOW 3 32 56 VTop 2
SYMATTR InstName R14
SYMATTR Value 100
SYMBOL cap -3872 224 R0
SYMATTR InstName C4
SYMATTR Value 1n
SYMBOL res -3888 320 R90
WINDOW 0 0 56 VBottom 2
WINDOW 3 32 56 VTop 2
SYMATTR InstName R15
SYMATTR Value 1k
SYMBOL res -3664 320 R90
WINDOW 0 0 56 VBottom 2
WINDOW 3 32 56 VTop 2
SYMATTR InstName R16
SYMATTR Value 10k
SYMBOL res -3568 496 R180
WINDOW 0 36 76 Left 2
WINDOW 3 36 40 Left 2
SYMATTR InstName R18
SYMATTR Value 10k
SYMBOL cap -3808 384 R0
SYMATTR InstName C7
SYMATTR Value 1n
SYMBOL res -2752 304 R90
WINDOW 0 0 56 VBottom 2
WINDOW 3 32 56 VTop 2
SYMATTR InstName R11
SYMATTR Value 470
SYMBOL res -2128 416 R90
WINDOW 0 0 56 VBottom 2
WINDOW 3 32 56 VTop 2
SYMATTR InstName R26
SYMATTR Value 10k
SYMBOL res -2656 816 R90
WINDOW 0 0 56 VBottom 2
WINDOW 3 32 56 VTop 2
SYMATTR InstName R27
SYMATTR Value 220
SYMBOL res -2448 672 R90
WINDOW 0 0 56 VBottom 2
WINDOW 3 32 56 VTop 2
SYMATTR InstName R28
SYMATTR Value 47k
SYMBOL res -2672 832 R0
SYMATTR InstName R29
SYMATTR Value 10k
SYMBOL cap -3200 816 R90
WINDOW 0 0 32 VBottom 2
WINDOW 3 32 32 VTop 2
SYMATTR InstName C8
SYMATTR Value 4.7µ
SYMBOL res -3056 816 R90
WINDOW 0 0 56 VBottom 2
WINDOW 3 32 56 VTop 2
SYMATTR InstName R30
SYMATTR Value 0
SYMBOL res -3024 992 R180
WINDOW 0 36 76 Left 2
WINDOW 3 36 40 Left 2
SYMATTR InstName R31
SYMATTR Value 50k
SYMBOL res -2912 816 R90
WINDOW 0 0 56 VBottom 2
WINDOW 3 32 56 VTop 2
SYMATTR InstName R32
SYMATTR Value 10k
SYMBOL diode -2864 912 R180
WINDOW 0 24 64 Left 2
WINDOW 3 24 0 Left 2
SYMATTR InstName D2
SYMATTR Value 1N4148
SYMBOL OpAmps\\OP27 -3536 768 R0
SYMATTR InstName U8
SYMBOL OpAmps\\OP27 -2496 784 R0
SYMATTR InstName U10
SYMBOL res -3888 656 R90
WINDOW 0 0 56 VBottom 2
WINDOW 3 32 56 VTop 2
SYMATTR InstName R33
SYMATTR Value 1k
SYMBOL res -3712 656 R90
WINDOW 0 0 56 VBottom 2
WINDOW 3 32 56 VTop 2
SYMATTR InstName R34
SYMATTR Value 10k
SYMBOL res -3488 656 R90
WINDOW 0 0 56 VBottom 2
WINDOW 3 32 56 VTop 2
SYMATTR InstName R35
SYMATTR Value 10k
SYMBOL res -3280 816 R90
WINDOW 0 0 56 VBottom 2
WINDOW 3 32 56 VTop 2
SYMATTR InstName R36
SYMATTR Value 100
SYMBOL cap -3872 736 R0
SYMATTR InstName C9
SYMATTR Value 1n
SYMBOL res -3888 832 R90
WINDOW 0 0 56 VBottom 2
WINDOW 3 32 56 VTop 2
SYMATTR InstName R37
SYMATTR Value 1k
SYMBOL res -3664 832 R90
WINDOW 0 0 56 VBottom 2
WINDOW 3 32 56 VTop 2
SYMATTR InstName R38
SYMATTR Value 10k
SYMBOL res -3568 1008 R180
WINDOW 0 36 76 Left 2
WINDOW 3 36 40 Left 2
SYMATTR InstName R39
SYMATTR Value 10k
SYMBOL cap -3808 896 R0
SYMATTR InstName C10
SYMATTR Value 1n
SYMBOL res -2752 816 R90
WINDOW 0 0 56 VBottom 2
WINDOW 3 32 56 VTop 2
SYMATTR InstName R40
SYMATTR Value 470
SYMBOL res -4448 144 R90
WINDOW 0 0 56 VBottom 2
WINDOW 3 32 56 VTop 2
SYMATTR InstName R21
SYMATTR Value 100
SYMBOL res -4448 320 R90
WINDOW 0 0 56 VBottom 2
WINDOW 3 32 56 VTop 2
SYMATTR InstName R24
SYMATTR Value 100
SYMBOL OpAmps\\ADTL084 -1376 1136 R0
SYMATTR InstName U11
SYMBOL res -1680 1168 R90
WINDOW 0 0 56 VBottom 2
WINDOW 3 32 56 VTop 2
SYMATTR InstName R25
SYMATTR Value 75k
SYMBOL res -1520 1168 R90
WINDOW 0 0 56 VBottom 2
WINDOW 3 32 56 VTop 2
SYMATTR InstName R41
SYMATTR Value 18k
SYMBOL res -1328 1040 R90
WINDOW 0 0 56 VBottom 2
WINDOW 3 32 56 VTop 2
SYMATTR InstName R42
SYMATTR Value 91k
SYMBOL cap -1712 1056 R90
WINDOW 0 0 32 VBottom 2
WINDOW 3 32 32 VTop 2
SYMATTR InstName C6
SYMATTR Value 1n
SYMBOL OpAmps\\ADTL084 544 1792 M90
SYMATTR InstName U12
SYMBOL OpAmps\\ADTL084 2176 1760 M180
SYMATTR InstName U13
SYMBOL OpAmps\\ADTL084 320 1632 M270
SYMATTR InstName U14
SYMBOL OpAmps\\ADTL084 1936 1744 M180
SYMATTR InstName U15
SYMBOL res 576 1232 R90
WINDOW 0 0 56 VBottom 2
WINDOW 3 32 56 VTop 2
SYMATTR InstName R43
SYMATTR Value 11.5k
SYMBOL res 432 1424 R180
WINDOW 0 36 76 Left 2
WINDOW 3 36 40 Left 2
SYMATTR InstName R44
SYMATTR Value 5.23k
SYMBOL cap 400 1504 R0
SYMATTR InstName C11
SYMATTR Value 1000p
SYMBOL res 400 1600 R0
SYMATTR InstName R45
SYMATTR Value 11.8k
SYMBOL cap 400 1760 R0
SYMATTR InstName C12
SYMATTR Value 1000p
SYMBOL res 400 1872 R0
SYMATTR InstName R46
SYMATTR Value 10k
SYMBOL res 400 2048 R0
SYMATTR InstName R47
SYMATTR Value 10k
SYMBOL OpAmps\\ADTL084 1104 1792 M90
SYMATTR InstName U16
SYMBOL OpAmps\\ADTL084 880 1632 M270
SYMATTR InstName U17
SYMBOL res 1136 1232 R90
WINDOW 0 0 56 VBottom 2
WINDOW 3 32 56 VTop 2
SYMATTR InstName R48
SYMATTR Value 12.1k
SYMBOL res 992 1424 R180
WINDOW 0 36 76 Left 2
WINDOW 3 36 40 Left 2
SYMATTR InstName R49
SYMATTR Value 9.31k
SYMBOL cap 960 1504 R0
SYMATTR InstName C13
SYMATTR Value 1000p
SYMBOL res 960 1600 R0
SYMATTR InstName R50
SYMATTR Value 8.66k
SYMBOL cap 960 1760 R0
SYMATTR InstName C14
SYMATTR Value 1000p
SYMBOL res 960 1872 R0
SYMATTR InstName R51
SYMATTR Value 10k
SYMBOL res 960 2048 R0
SYMATTR InstName R52
SYMATTR Value 10k
SYMBOL OpAmps\\ADTL084 1648 1792 M90
SYMATTR InstName U20
SYMBOL OpAmps\\ADTL084 1424 1632 M270
SYMATTR InstName U21
SYMBOL res 1680 1232 R90
WINDOW 0 0 56 VBottom 2
WINDOW 3 32 56 VTop 2
SYMATTR InstName R53
SYMATTR Value 6.19k
SYMBOL res 1536 1424 R180
WINDOW 0 36 76 Left 2
WINDOW 3 36 40 Left 2
SYMATTR InstName R54
SYMATTR Value 2k
SYMBOL cap 1504 1504 R0
SYMATTR InstName C15
SYMATTR Value 1000p
SYMBOL res 1504 1600 R0
SYMATTR InstName R55
SYMATTR Value 12.1k
SYMBOL cap 1504 1760 R0
SYMATTR InstName C16
SYMATTR Value 1000p
SYMBOL res 1504 1872 R0
SYMATTR InstName R56
SYMATTR Value 10k
SYMBOL res 1504 2048 R0
SYMATTR InstName R57
SYMATTR Value 10k
SYMBOL cap 1808 2048 R0
SYMATTR InstName C17
SYMATTR Value 1000p
SYMBOL res 2240 1808 R90
WINDOW 0 0 56 VBottom 2
WINDOW 3 32 56 VTop 2
SYMATTR InstName R58
SYMATTR Value 20k
SYMBOL res 2128 1984 R180
WINDOW 0 36 76 Left 2
WINDOW 3 36 40 Left 2
SYMATTR InstName R59
SYMATTR Value 10k
SYMBOL OpAmps\\ADTL084 -976 1152 R0
SYMATTR InstName U22
SYMBOL res -928 1056 R90
WINDOW 0 0 56 VBottom 2
WINDOW 3 32 56 VTop 2
SYMATTR InstName R60
SYMATTR Value 10k
SYMBOL cap -720 1200 R90
WINDOW 0 0 32 VBottom 2
WINDOW 3 32 32 VTop 2
SYMATTR InstName C18
SYMATTR Value 220n
SYMBOL res -688 1232 R0
SYMATTR InstName R61
SYMATTR Value 1k5
SYMBOL res -688 1344 R0
SYMATTR InstName R62
SYMATTR Value 50k
SYMBOL zener -512 1376 R0
SYMATTR InstName D3
SYMATTR Value BZX84C8V2L
SYMBOL zener -480 1328 R180
WINDOW 0 24 64 Left 2
WINDOW 3 24 0 Left 2
SYMATTR InstName D5
SYMATTR Value BZX84C8V2L
SYMBOL OpAmps\\ADTL084 -368 1296 M180
SYMATTR InstName U23
SYMBOL res -112 1216 R90
WINDOW 0 0 56 VBottom 2
WINDOW 3 32 56 VTop 2
SYMATTR InstName R63
SYMATTR Value 3k3
SYMBOL res 32 1216 R90
WINDOW 0 0 56 VBottom 2
WINDOW 3 32 56 VTop 2
SYMATTR InstName R64
SYMATTR Value 1
SYMBOL cap 48 1312 R0
SYMATTR InstName C19
SYMATTR Value 1n
SYMBOL OpAmps\\ADTL084 224 1312 M180
SYMATTR InstName U24
SYMBOL res -1024 1184 R90
WINDOW 0 0 56 VBottom 2
WINDOW 3 32 56 VTop 2
SYMATTR InstName R65
SYMATTR Value 10k
SYMBOL cap -3696 2448 R90
WINDOW 0 0 32 VBottom 2
WINDOW 3 32 32 VTop 2
SYMATTR InstName C20
SYMATTR Value 220n
SYMBOL cap -3504 2592 R180
WINDOW 0 24 56 Left 2
WINDOW 3 24 8 Left 2
SYMATTR InstName C21
SYMATTR Value 1000p
SYMBOL res -3536 2448 R90
WINDOW 0 0 56 VBottom 2
WINDOW 3 32 56 VTop 2
SYMATTR InstName R66
SYMATTR Value 3k3
SYMBOL res -3648 2624 R180
WINDOW 0 36 76 Left 2
WINDOW 3 36 40 Left 2
SYMATTR InstName R67
SYMATTR Value 33k
SYMBOL OpAmps\\ADTL084 -3424 2384 R0
SYMATTR InstName U25
SYMBOL res -3200 2432 R90
WINDOW 0 0 56 VBottom 2
WINDOW 3 32 56 VTop 2
SYMATTR InstName R68
SYMATTR Value 7k5
SYMBOL cap -3184 2528 R0
SYMATTR InstName C22
SYMATTR Value 220p
SYMBOL res -3184 2624 R0
SYMATTR InstName R69
SYMATTR Value 38.3k
SYMBOL res -3184 2784 R0
SYMATTR InstName R70
SYMATTR Value 38.3k
SYMBOL cap -3024 2736 R90
WINDOW 0 0 32 VBottom 2
WINDOW 3 32 32 VTop 2
SYMATTR InstName C23
SYMATTR Value 1000p
SYMBOL OpAmps\\ADTL084 -3024 2368 R0
SYMATTR InstName U26
SYMBOL OpAmps\\ADTL084 -2960 2688 M180
SYMATTR InstName U27
SYMBOL res -2752 2416 R90
WINDOW 0 0 56 VBottom 2
WINDOW 3 32 56 VTop 2
SYMATTR InstName R71
SYMATTR Value 2.61k
SYMBOL OpAmps\\ADTL084 -2560 2384 R0
SYMATTR InstName U28
SYMBOL res -2512 2288 R90
WINDOW 0 0 56 VBottom 2
WINDOW 3 32 56 VTop 2
SYMATTR InstName R72
SYMATTR Value 10k
SYMBOL res -2608 2416 R90
WINDOW 0 0 56 VBottom 2
WINDOW 3 32 56 VTop 2
SYMATTR InstName R73
SYMATTR Value 2k
SYMBOL cap -2304 2432 R90
WINDOW 0 0 32 VBottom 2
WINDOW 3 32 32 VTop 2
SYMATTR InstName C27
SYMATTR Value 220n
SYMBOL res -2272 2464 R0
SYMATTR InstName R76
SYMATTR Value 1k5
SYMBOL res -2272 2576 R0
SYMATTR InstName R77
SYMATTR Value 50k
SYMBOL zener -2096 2608 R0
SYMATTR InstName D6
SYMATTR Value BZX84C8V2L
SYMBOL zener -2064 2560 R180
WINDOW 0 24 64 Left 2
WINDOW 3 24 0 Left 2
SYMATTR InstName D7
SYMATTR Value BZX84C8V2L
SYMBOL OpAmps\\ADTL084 -1952 2528 M180
SYMATTR InstName U30
SYMBOL res -1696 2448 R90
WINDOW 0 0 56 VBottom 2
WINDOW 3 32 56 VTop 2
SYMATTR InstName R79
SYMATTR Value 3k3
SYMBOL res -1552 2448 R90
WINDOW 0 0 56 VBottom 2
WINDOW 3 32 56 VTop 2
SYMATTR InstName R81
SYMATTR Value 1
SYMBOL cap -1536 2544 R0
SYMATTR InstName C28
SYMATTR Value 1n
SYMBOL OpAmps\\ADTL084 -1024 3024 M90
SYMATTR InstName U31
SYMBOL OpAmps\\ADTL084 608 2992 M180
SYMATTR InstName U32
SYMBOL OpAmps\\ADTL084 -1248 2864 M270
SYMATTR InstName U33
SYMBOL OpAmps\\ADTL084 368 2976 M180
SYMATTR InstName U34
SYMBOL res -992 2464 R90
WINDOW 0 0 56 VBottom 2
WINDOW 3 32 56 VTop 2
SYMATTR InstName R84
SYMATTR Value 11.5k
SYMBOL res -1136 2656 R180
WINDOW 0 36 76 Left 2
WINDOW 3 36 40 Left 2
SYMATTR InstName R85
SYMATTR Value 5.23k
SYMBOL cap -1168 2736 R0
SYMATTR InstName C31
SYMATTR Value 1000p
SYMBOL res -1168 2832 R0
SYMATTR InstName R86
SYMATTR Value 11.8k
SYMBOL cap -1168 2992 R0
SYMATTR InstName C32
SYMATTR Value 1000p
SYMBOL res -1168 3104 R0
SYMATTR InstName R87
SYMATTR Value 10k
SYMBOL res -1168 3280 R0
SYMATTR InstName R88
SYMATTR Value 10k
SYMBOL OpAmps\\ADTL084 -464 3024 M90
SYMATTR InstName U35
SYMBOL OpAmps\\ADTL084 -688 2864 M270
SYMATTR InstName U36
SYMBOL res -432 2464 R90
WINDOW 0 0 56 VBottom 2
WINDOW 3 32 56 VTop 2
SYMATTR InstName R89
SYMATTR Value 12.1k
SYMBOL res -576 2656 R180
WINDOW 0 36 76 Left 2
WINDOW 3 36 40 Left 2
SYMATTR InstName R90
SYMATTR Value 9.31k
SYMBOL cap -608 2736 R0
SYMATTR InstName C33
SYMATTR Value 1000p
SYMBOL res -608 2832 R0
SYMATTR InstName R97
SYMATTR Value 8.66k
SYMBOL cap -608 2992 R0
SYMATTR InstName C34
SYMATTR Value 1000p
SYMBOL res -608 3104 R0
SYMATTR InstName R98
SYMATTR Value 10k
SYMBOL res -608 3280 R0
SYMATTR InstName R99
SYMATTR Value 10k
SYMBOL OpAmps\\ADTL084 80 3024 M90
SYMATTR InstName U37
SYMBOL OpAmps\\ADTL084 -144 2864 M270
SYMATTR InstName U38
SYMBOL res 112 2464 R90
WINDOW 0 0 56 VBottom 2
WINDOW 3 32 56 VTop 2
SYMATTR InstName R100
SYMATTR Value 6.19k
SYMBOL res -32 2656 R180
WINDOW 0 36 76 Left 2
WINDOW 3 36 40 Left 2
SYMATTR InstName R101
SYMATTR Value 2k
SYMBOL cap -64 2736 R0
SYMATTR InstName C35
SYMATTR Value 1000p
SYMBOL res -64 2832 R0
SYMATTR InstName R102
SYMATTR Value 12.1k
SYMBOL cap -64 2992 R0
SYMATTR InstName C36
SYMATTR Value 1000p
SYMBOL res -64 3104 R0
SYMATTR InstName R103
SYMATTR Value 10k
SYMBOL res -64 3280 R0
SYMATTR InstName R104
SYMATTR Value 10k
SYMBOL cap 240 3280 R0
SYMATTR InstName C37
SYMATTR Value 1000p
SYMBOL res 672 3040 R90
WINDOW 0 0 56 VBottom 2
WINDOW 3 32 56 VTop 2
SYMATTR InstName R109
SYMATTR Value 20k
SYMBOL res 560 3216 R180
WINDOW 0 36 76 Left 2
WINDOW 3 36 40 Left 2
SYMATTR InstName R110
SYMATTR Value 10k
SYMBOL OpAmps\\ADTL084 -1344 2544 M180
SYMATTR InstName U39
SYMBOL OpAmps\\ADTL084 -4544 2352 R0
SYMATTR InstName U40
SYMBOL current -4976 2592 R0
WINDOW 123 24 28 Left 2
WINDOW 39 0 0 Left 0
SYMATTR Value2 AC 1
SYMATTR InstName I1
SYMATTR Value SINE(-4m 4m 1000 0 0 0 1000)
SYMBOL res -4672 2416 R0
SYMATTR InstName R111
SYMATTR Value 330
SYMBOL res -4752 2416 R0
SYMATTR InstName R112
SYMATTR Value 330
SYMBOL res -4320 2400 R90
WINDOW 0 0 56 VBottom 2
WINDOW 3 32 56 VTop 2
SYMATTR InstName R113
SYMATTR Value 221
SYMBOL cap -4320 2416 R0
SYMATTR InstName C38
SYMATTR Value 220p
SYMBOL cap -4512 2288 R90
WINDOW 0 0 32 VBottom 2
WINDOW 3 32 32 VTop 2
SYMATTR InstName C39
SYMATTR Value 220p
SYMBOL cap -4512 2192 R90
WINDOW 0 0 32 VBottom 2
WINDOW 3 32 32 VTop 2
SYMATTR InstName C40
SYMATTR Value 220p
SYMBOL res -4480 2096 R90
WINDOW 0 0 56 VBottom 2
WINDOW 3 32 56 VTop 2
SYMATTR InstName R114
SYMATTR Value 330
SYMBOL res -4480 2000 R90
WINDOW 0 0 56 VBottom 2
WINDOW 3 32 56 VTop 2
SYMATTR InstName R115
SYMATTR Value 330
SYMBOL res -4480 1904 R90
WINDOW 0 0 56 VBottom 2
WINDOW 3 32 56 VTop 2
SYMATTR InstName R116
SYMATTR Value 20500
SYMBOL res -4816 2416 R90
WINDOW 0 0 56 VBottom 2
WINDOW 3 32 56 VTop 2
SYMATTR InstName R117
SYMATTR Value 30
SYMBOL OpAmps\\ADTL084 -3968 2400 R0
SYMATTR InstName U41
SYMBOL res -4080 2400 R90
WINDOW 0 0 56 VBottom 2
WINDOW 3 32 56 VTop 2
SYMATTR InstName R118
SYMATTR Value 1k
SYMBOL res -4192 2528 R270
WINDOW 0 32 56 VTop 2
WINDOW 3 0 56 VBottom 2
SYMATTR InstName R119
SYMATTR Value 1k
SYMBOL res -3904 2304 R90
WINDOW 0 0 56 VBottom 2
WINDOW 3 32 56 VTop 2
SYMATTR InstName R120
SYMATTR Value 16k2
SYMBOL cap -3936 2224 R90
WINDOW 0 0 32 VBottom 2
WINDOW 3 32 32 VTop 2
SYMATTR InstName C41
SYMATTR Value 220p
TEXT -5016 1496 Left 2 !.ac dec 200 1 24000
TEXT -5016 1448 Left 2 !;tran 0 250ms 230ms 0.0000762939453125
TEXT -5016 1536 Left 2 !;noise V(3) V3 oct 24 20 20k
TEXT -1504 368 Left 2 ;360Hz LowPass
TEXT -1864 512 Left 2 ;= Summed Input
TEXT -4832 336 Left 2 ;Input +
TEXT -4840 160 Left 2 ;Input -
TEXT -2808 488 VRight 2 ;4053 On Resistance
TEXT -4720 592 Left 2 !;step param X 100 100 0
TEXT -5024 1576 Left 2 !.param X=175 Y=.316
TEXT -1640 1072 Left 2 ;PreEmphasis
TEXT -3736 2384 Left 2 ;Reverb Fixed EQ
TEXT -3272 2376 Left 2 ;9KHz DIP Filter

The netlist it stands for:
* stargate_323_ltspice_comparator.asc
V1 V+ 0 15
V2 V- 0 -15
R105 N034 N029 1k6
R106 N038 N034 1k6
C70 N032 N034 220n
C69 0 N038 220n
XU2 N038 N032 V+ V- N032 ADTL084  ; pins In+ In- V+ V- OUT
C73 N036 N032 220n
R107 N030 N036 6k8
R108 N031 N030 56k
XU3 0 N030 V+ V- N031 ADTL084  ; pins In+ In- V+ V- OUT
XU4 0 N028 V+ V- N029 ADTL084  ; pins In+ In- V+ V- OUT
R78 N029 N028 10k
R80 N028 N037 10k
R6 N033 N024 16k
XU18 0 N024 V+ V- N039 ADTL084  ; pins In+ In- V+ V- OUT
XU19 N033 N025 V+ V- N025 ADTL084  ; pins In+ In- V+ V- OUT
R8 N024 N031 33k
R7 RatLVL N025 100
R12 N025 N024 33k
D1 N039 N033 1N4148
R22 N019 N018 220
R23 N012 N019 47k
R9 N019 0 10k
C5 N015 N014 4.7µ
R17 N016 N015 0
R19 0 N016 50k
R20 N017 N016 10k
D4 0 N017 1N4148
R91 N003 RatLVL 2k2
R92 N004 5V 1k
R93 N013 N004 330
R94 N035 N013 82
R95 N045 N035 36
R96 N045 0 16
C24 N003 0 22µ
C25 N004 0 22µ
V4 5V 0 5
XU46 0 N003 N004 0 N002 N001 Comp3 5V LT1011
C29 N002 N001 .1µ
XU1 0 N003 N035 0 N027 N026 Comp1 5V LT1011
C1 N027 N026 .1µ
XU5 0 N003 N045 0 N041 N040 Comp0 5V LT1011
C2 N041 N040 .1µ
XU6 0 N003 N013 0 N006 N005 Comp2 5V LT1011
C3 N006 N005 .1µ
R1 5V Comp3 3k3
R2 5V Comp2 3k3
R3 5V Comp1 3k3
R4 5V Comp0 3k3
XU7 N023 N010 V+ V- N011 OP27  ; pins In+ In- V+ V- OUT
V5 N020 0 SINE(0 {Y} {X} 0 0 0 1000) AC 1 0
V6 N007 0 SINE(0 {Y} {X} 0 0 180 1000) AC 1 180
XU9 0 N019 V+ V- N012 OP27  ; pins In+ In- V+ V- OUT
R5 N009 N008 1k
R10 N010 N009 10k
R13 N011 N010 10k
R14 N014 N011 100
C4 N009 0 1n
R15 N022 N021 1k
R16 N023 N022 10k
R18 0 N023 10k
C7 N022 0 1n
R11 N018 N017 470
R26 N028 N012 10k
R27 N051 N050 220
R28 N037 N051 47k
R29 N051 0 10k
C8 N047 N046 4.7µ
R30 N048 N047 0
R31 0 N048 50k
R32 N049 N048 10k
D2 0 N049 1N4148
XU8 N053 N043 V+ V- N044 OP27  ; pins In+ In- V+ V- OUT
XU10 0 N051 V+ V- N037 OP27  ; pins In+ In- V+ V- OUT
R33 N042 N008 1k
R34 N043 N042 10k
R35 N044 N043 10k
R36 N046 N044 100
C9 N042 0 1n
R37 N052 N021 1k
R38 N053 N052 10k
R39 0 N053 10k
C10 N052 0 1n
R40 N050 N049 470
R21 N008 N007 100
R24 N021 N020 100
XU11 0 N054 V+ V- N055 ADTL084  ; pins In+ In- V+ V- OUT
R25 N056 N029 75k
R41 N054 N056 18k
R42 N055 N054 91k
C6 N056 N029 1n
XU12 N069 N076 V+ V- N080 ADTL084  ; pins In+ In- V+ V- OUT
XU13 N075 N079 V+ V- AIN2 ADTL084  ; pins In+ In- V+ V- OUT
XU14 N085 N076 V+ V- N072 ADTL084  ; pins In+ In- V+ V- OUT
XU15 N066 N075 V+ V- N075 ADTL084  ; pins In+ In- V+ V- OUT
R43 N064 N063 11.5k
R44 N069 N063 5.23k
C11 N069 N072 1000p
R45 N072 N076 11.8k
C12 N076 N080 1000p
R46 N080 N085 10k
R47 N085 0 10k
XU16 N070 N077 V+ V- N081 ADTL084  ; pins In+ In- V+ V- OUT
XU17 N086 N077 V+ V- N073 ADTL084  ; pins In+ In- V+ V- OUT
R48 N065 N064 12.1k
R49 N070 N064 9.31k
C13 N070 N073 1000p
R50 N073 N077 8.66k
C14 N077 N081 1000p
R51 N081 N086 10k
R52 N086 0 10k
XU20 N071 N078 V+ V- N082 ADTL084  ; pins In+ In- V+ V- OUT
XU21 N087 N078 V+ V- N074 ADTL084  ; pins In+ In- V+ V- OUT
R53 N066 N065 6.19k
R54 N071 N065 2k
C15 N071 N074 1000p
R55 N074 N078 12.1k
C16 N078 N082 1000p
R56 N082 N087 10k
R57 N087 0 10k
C17 N066 0 1000p
R58 AIN2 N079 20k
R59 0 N079 10k
XU22 0 N057 V+ V- N058 ADTL084  ; pins In+ In- V+ V- OUT
R60 N058 N057 10k
C18 N059 N058 220n
R61 N059 N067 1k5
R62 N067 0 50k
D3 N068 0 BZX84C8V2L
D5 N068 N059 BZX84C8V2L
XU23 N059 N060 V+ V- N060 ADTL084  ; pins In+ In- V+ V- OUT
R63 N061 N060 3k3
R64 N062 N061 1
C19 N062 0 1n
XU24 N062 N063 V+ V- N063 ADTL084  ; pins In+ In- V+ V- OUT
R65 N057 N055 10k
C20 N100 N089 220n
C21 0 N101 1000p
R66 N101 N100 3k3
R67 0 N100 33k
XU25 N101 N093 V+ V- N093 ADTL084  ; pins In+ In- V+ V- OUT
R68 N098 N093 7k5
C22 N098 N110 220p
R69 N110 N116 38.3k
R70 N116 0 38.3k
C23 N112 N116 1000p
XU26 N098 N092 V+ V- N092 ADTL084  ; pins In+ In- V+ V- OUT
XU27 N110 N112 V+ V- N112 ADTL084  ; pins In+ In- V+ V- OUT
R71 N097 N092 2.61k
XU28 0 N090 V+ V- N091 ADTL084  ; pins In+ In- V+ V- OUT
R72 N091 N090 10k
R73 N090 N097 2k
C27 N099 N091 220n
R76 N099 N109 1k5
R77 N109 0 50k
D6 N111 0 BZX84C8V2L
D7 N111 N099 BZX84C8V2L
XU30 N099 N102 V+ V- N102 ADTL084  ; pins In+ In- V+ V- OUT
R79 N103 N102 3k3
R81 N104 N103 1
C28 N104 0 1n
XU31 N113 N121 V+ V- N125 ADTL084  ; pins In+ In- V+ V- OUT
XU32 N120 N124 V+ V- AIN1 ADTL084  ; pins In+ In- V+ V- OUT
XU33 N128 N121 V+ V- N117 ADTL084  ; pins In+ In- V+ V- OUT
XU34 N108 N120 V+ V- N120 ADTL084  ; pins In+ In- V+ V- OUT
R84 N106 N105 11.5k
R85 N113 N105 5.23k
C31 N113 N117 1000p
R86 N117 N121 11.8k
C32 N121 N125 1000p
R87 N125 N128 10k
R88 N128 0 10k
XU35 N114 N122 V+ V- N126 ADTL084  ; pins In+ In- V+ V- OUT
XU36 N129 N122 V+ V- N118 ADTL084  ; pins In+ In- V+ V- OUT
R89 N107 N106 12.1k
R90 N114 N106 9.31k
C33 N114 N118 1000p
R97 N118 N122 8.66k
C34 N122 N126 1000p
R98 N126 N129 10k
R99 N129 0 10k
XU37 N115 N123 V+ V- N127 ADTL084  ; pins In+ In- V+ V- OUT
XU38 N130 N123 V+ V- N119 ADTL084  ; pins In+ In- V+ V- OUT
R100 N108 N107 6.19k
R101 N115 N107 2k
C35 N115 N119 1000p
R102 N119 N123 12.1k
C36 N123 N127 1000p
R103 N127 N130 10k
R104 N130 0 10k
C37 N108 0 1000p
R109 AIN1 N124 20k
R110 0 N124 10k
XU39 N104 N105 V+ V- N105 ADTL084  ; pins In+ In- V+ V- OUT
XU40 N096 N083 V+ V- N084 ADTL084  ; pins In+ In- V+ V- OUT
I1 N095 0 SINE(-4m 4m 1000 0 0 0 1000) AC 1
R111 N096 0 330
R112 N096 0 330
R113 N094 N084 221
C38 N094 0 220p
C39 N084 N083 220p
C40 N084 N083 220p
R114 N084 N083 330
R115 N084 N083 330
R116 N084 N083 20500
R117 N096 N095 30
XU41 0 N088 V+ V- N089 ADTL084  ; pins In+ In- V+ V- OUT
R118 N088 N094 1k
R119 N094 0 1k
R120 N089 N088 16k2
C41 N089 N088 220p
.model D D
.lib standard.dio
.ac dec 200 1 24000
;tran 0 250ms 230ms 0.0000762939453125
;noise V(3) V3 oct 24 20 20k
* 360Hz LowPass
* = Summed Input
* Input +
* Input -
* 4053 On Resistance
;step param X 100 100 0
.param X=175 Y=.316
* PreEmphasis
* Reverb Fixed EQ
* 9KHz DIP Filter
.lib ADTL084.lib
.lib LTC1.lib
.lib ADI.lib
.backanno
.end